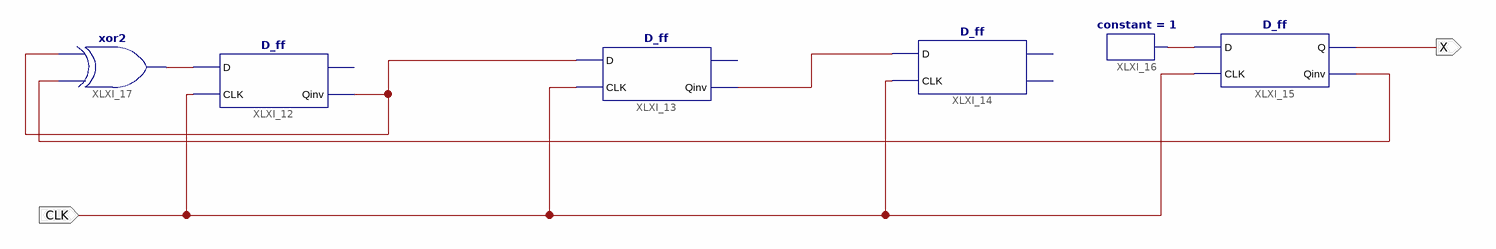
[diagram p0: schematic sheet 1]
// Xilinx ISE schematic sequencegen.sch (artix7) as structural Verilog: 6 symbols, 2 ports
module sequencegen (
  input  CLK,
  output X
);

  wire XLXN_25, XLXN_27, XLXN_29, XLXN_30, XLXN_31;

  D_ff XLXI_12 (.D(XLXN_31), .CLK(CLK), .Qinv(XLXN_29));  // open: Q
  D_ff XLXI_13 (.D(XLXN_29), .CLK(CLK), .Qinv(XLXN_30));  // open: Q
  D_ff XLXI_14 (.D(XLXN_30), .CLK(CLK));  // open: Q, Qinv
  D_ff XLXI_15 (.D(XLXN_25), .CLK(CLK), .Q(X), .Qinv(XLXN_27));
  constant #(.CValue("1")) XLXI_16 (.O(XLXN_25));
  xor XLXI_17 (XLXN_31, XLXN_27, XLXN_29);
endmodule
